# EAGLE design Rear_brake_lamp_v2 (EAGLE 7.3.0)
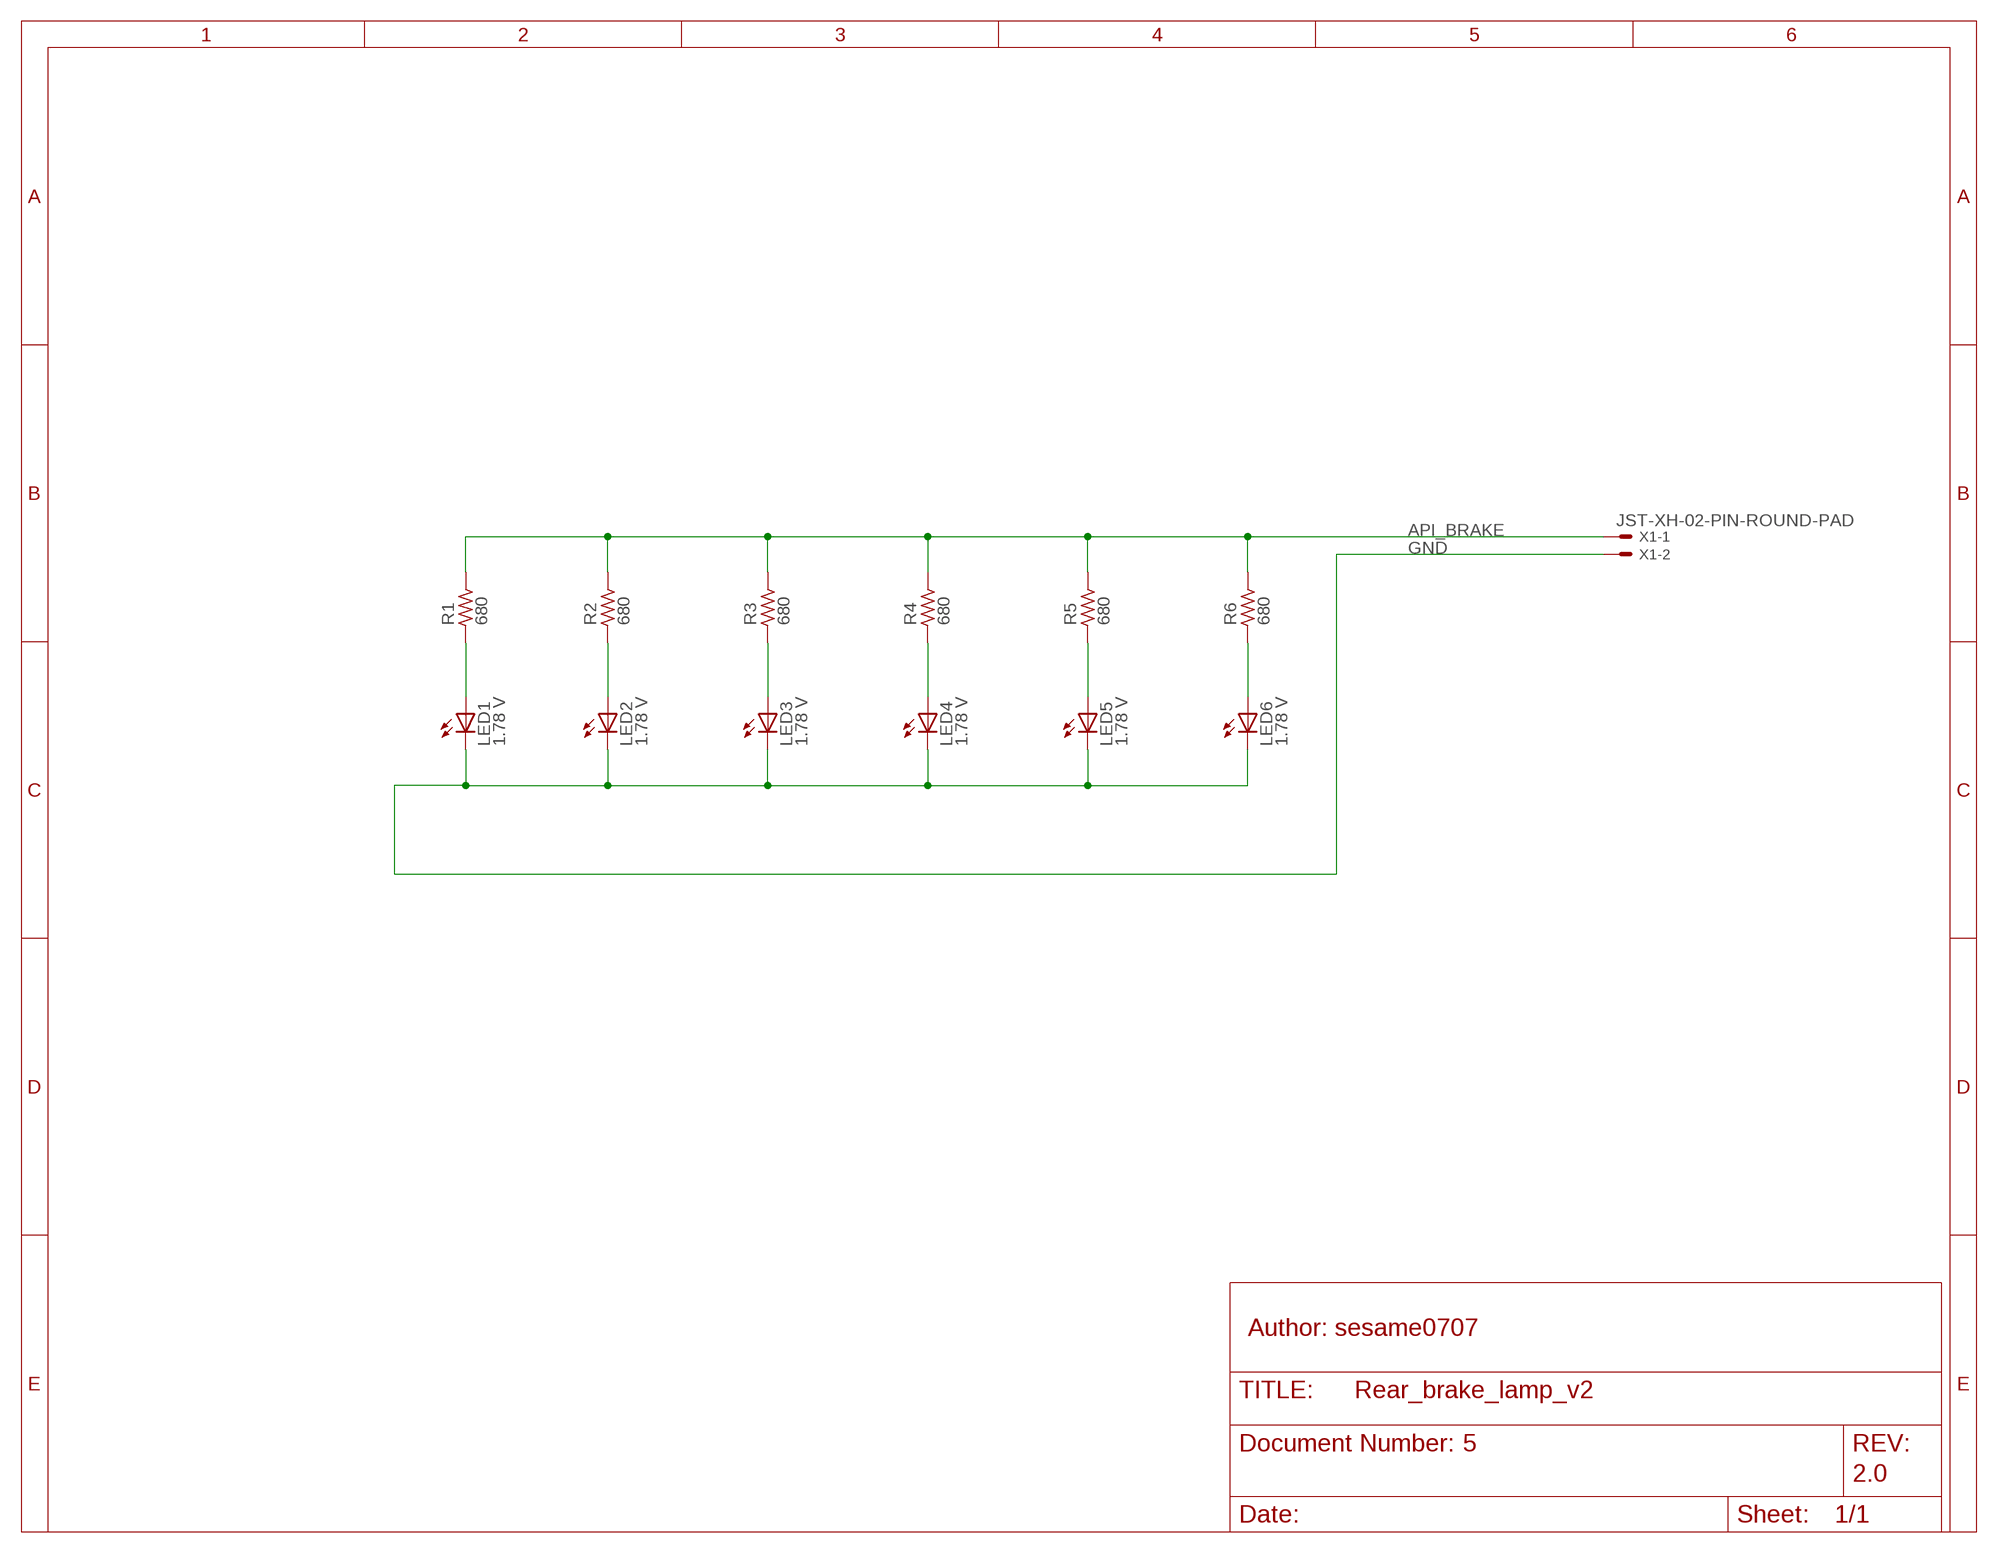
[diagram p0: schematic, sheet 1]

## Parts
LED1  1.78 V  LED5MM  [LED5MM]
LED2  1.78 V  LED5MM  [LED5MM]
LED3  1.78 V  LED5MM  [LED5MM]
LED4  1.78 V  LED5MM  [LED5MM]
LED5  1.78 V  LED5MM  [LED5MM]
LED6  1.78 V  LED5MM  [LED5MM]
R1  680  R_0805  [R0805]
R2  680  R_0805  [R0805]
R3  680  R_0805  [R0805]
R4  680  R_0805  [R0805]
R5  680  R_0805  [R0805]
R6  680  R_0805  [R0805]
X1  JST-XH-02-PIN-ROUND-PAD  [JST-XH-02-PACKAGE-ROUND-PAD]

## Nets
API_BRAKE: R1.2 R2.2 R3.2 R4.2 R5.2 R6.2 X1.1
GND: LED1.K(C) LED2.K(C) LED3.K(C) LED4.K(C) LED5.K(C) LED6.K(C) X1.2
N$1: LED1.A R1.1
N$2: LED2.A R2.1
N$3: LED3.A R3.1
N$4: LED4.A R4.1
N$5: LED5.A R5.1
N$6: LED6.A R6.1

## Notes on the sheet
- Author: sesame0707
- 5
- 2.0

## Library data of the parts
LED1-LED6 = led:LED: LED OSRAM: - CHIPLED LG R971, LG N971, LY N971, LG Q971, LY Q971, LO R971, LY R971 LH N974, LH R974 LS Q976, LO Q976, LY Q976 LO Q996 - Hyper CHIPLED LW Q18S LB Q993, LB Q99A, LB R99A - SideLED LS A670, LO A670, LY A670, LG A670, LP A670 LB A673, LV A673, LT A673, LW A673 LH A674 LY A675 LS A676, LA A676, LO A676, LY A676, LW A676 LS A679, LY A679, LG A679 - Hyper Micro SIDELED® LS Y876, LA Y876, LO Y876, LY Y876 LT Y87S - SmartLED LW L88C, LW L88S LB L89C, LB L89S, LG L890 LS L89K, LO L89K, LY L89K LS L896, LA L896, LO L896, LY L896 - TOPLED LS T670, LO T670, LY T670, LG T670, LP T670 LSG T670, LSP T670, LSY T670, LOP T670, LYG T670 LG T671, LOG T671, LSG T671 LB T673, LV T673, LT T673, LW T673 LH T674 LS T676, LA T676, LO T676, LY T676, LB T676, LH T676, LSB T676, LW T676 LB T67C, LV T67C, LT T67C, LS T67K, LO T67K, LY T67K, LW E67C LS E67B, LA E67B, LO E67B, LY E67B, LB E67C, LV E67C, LT E67C LW T67C LS T679, LY T679, LG T679 LS T770, LO T770, LY T770, LG T770, LP T770 LB T773, LV T773, LT T773, LW T773 LH T774 LS E675, LA E675, LY E675, LS T675 LS T776, LA T776, LO T776, LY T776, LB T776 LHGB T686 LT T68C, LB T68C - Hyper Mini TOPLED® LB M676 - Mini TOPLED Santana® LG M470 LS M47K, LO M47K, LY M47K Source: http://www.osram.convergy.de LUXEON: - LUMILED® LXK2-PW12-R00, LXK2-PW12-S00, LXK2-PW14-U00, LXK2-PW14-V00 LXK2-PM12-R00, LXK2-PM12-S00, LXK2-PM14-U00 LXK2-PE12-Q00, LXK2-PE12-R00, LXK2-PE12-S00, LXK2-PE14-T00, LXK2-PE14-U00 LXK2-PB12-K00, LXK2-PB12-L00, LXK2-PB12-M00, LXK2-PB14-N00, LXK2-PB14-P00, LXK2-PB14-Q00 LXK2-PR12-L00, LXK2-PR12-M00, LXK2-PR14-Q00, LXK2-PR14-R00 LXK2-PD12-Q00, LXK2-PD12-R00, LXK2-PD12-S00 LXK2-PH12-R00, LXK2-PH12-S00 LXK2-PL12-P00, LXK2-PL12-Q00, LXK2-PL12-R00 Source: www.luxeon.com KINGBRIGHT: KA-3528ASYC Source: www.kingbright.com; COLOR: Red; CURRENT: 0.32 mA
R1-R6 = rc-master-smd:R_: RESISTOR
X1 = Rembrandt Electronics - JST XH Connectors v1-0:JST-XH-02-PIN: JST XH Connector 2 Pin Wire to board connector. Pitch: 2,54 mm, (0.100") Number of pins: 2 Created by Rembrandt Electronics www.rembrandtelectronics.com

## Board
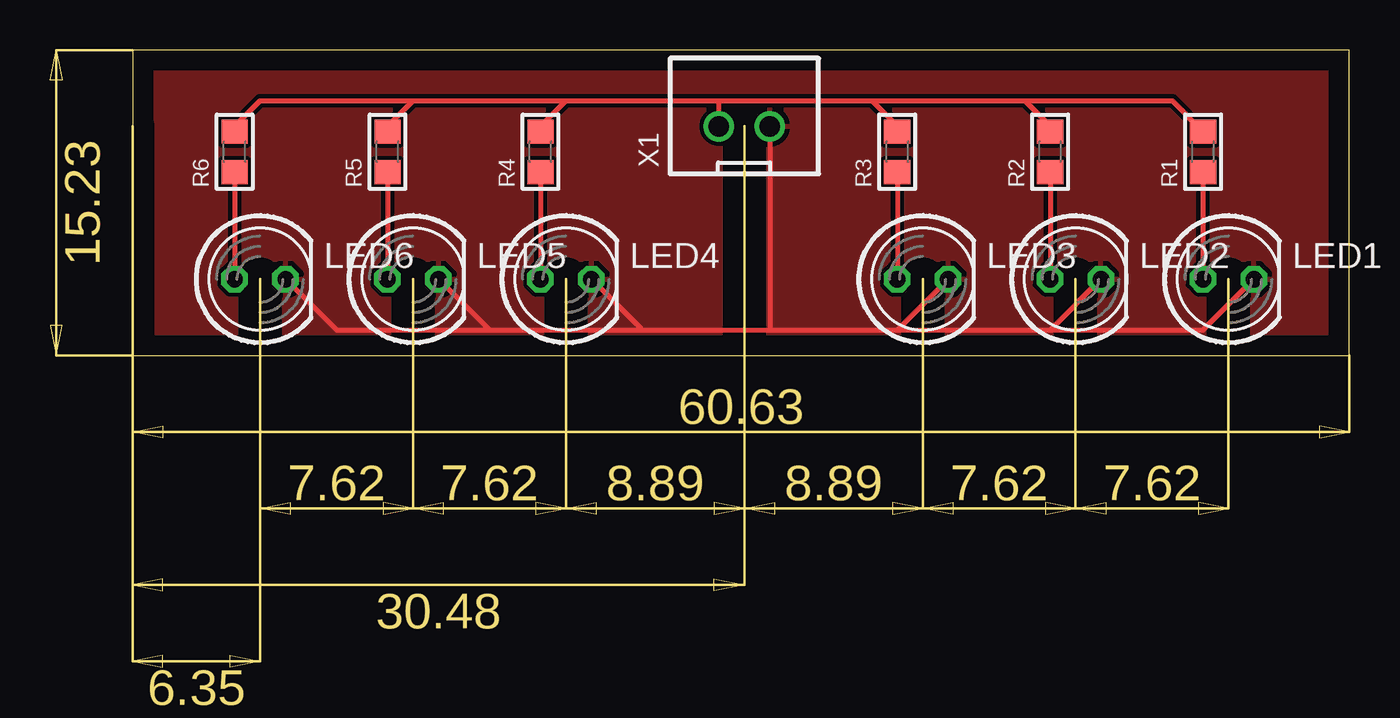
[diagram p1: board, top side]

Size 60.63 x 15.23 mm. Coordinates in mm from the lower left corner, seen from the top.
Outline: 0,0 60.63,0 60.63,15.23 0,15.23 0,0
Copper layers (1*16): Top 0.035mm / dielectric 1.5mm / Bottom 0.035mm
Design rules "default": minimum track width 10mil, minimum drill 24mil, track to track 8mil, track to pad 8mil, pad to pad 8mil, via to via 8mil, smd to smd 8mil, copper to edge 40mil, drill to drill 8mil, minimum pad ring 10mil, minimum via ring 8mil, stop-mask expansion 4mil, vias tented up to drill 0mil, thermal gap 10mil

### Footprints (pad centres in the part's own frame; a part is rotated, then mirrored left to right if it is on the bottom)
LED5MM = drill 0.813 octagon: A -1.27,0; K 1.27,0
R0805 = smd 1.2 x 1.3: 1 -1.016,0; 2 1.016,0
JST-XH-02-PACKAGE-ROUND-PAD = drill 1.016: 1 -1.27,0; 2 1.27,0

### Placement (x,y rotation side)
LED1  54.61,3.81 0 top
LED2  46.99,3.81 0 top
LED3  39.37,3.81 0 top
LED4  21.59,3.81 0 top
LED5  13.97,3.81 0 top
LED6  6.35,3.81 0 top
R1  53.34,10.16 90 top
R2  45.72,10.16 90 top
R3  38.1,10.16 90 top
R4  20.32,10.16 90 top
R5  12.7,10.16 90 top
R6  5.08,10.16 90 top
X1  30.48,11.43 0 top

### Tracks (layer width: path | path; a pad name or v marks a point on that pad's centre or on a via)
API_BRAKE
  Top 0.254: R6.2 5.08,11.43 6.35,12.7 13.97,12.7 | 13.97,12.7 21.59,12.7 | 21.59,12.7 29.21,12.7 | 29.21,12.7 36.83,12.7 | 36.83,12.7 44.45,12.7 | 44.45,12.7 51.82,12.7 R1.2 | R5.2 12.7,11.43 13.97,12.7 | R4.2 20.32,11.43 21.59,12.7 | R3.2 38.1,11.43 36.83,12.7 | R2.2 45.72,11.43 44.45,12.7 | X1.1 29.21,12.7
GND
  Top 0.254: LED6.K 10.16,1.27 17.78,1.27 | 17.78,1.27 25.4,1.27 | 25.4,1.27 31.75,1.27 | 31.75,1.27 38.1,1.27 | 38.1,1.27 45.72,1.27 | 45.72,1.27 53.34,1.27 LED1.K | LED2.K 45.72,1.27 | LED3.K 38.1,1.27 | LED5.K 17.78,1.27 | LED4.K 25.4,1.27 | X1.2 31.75,1.27
  pour Top: 0,0 0,15.24 60.96,15.24 60.96,0
N$1
  Top 0.254: R1.1 LED1.A
N$2
  Top 0.254: R2.1 LED2.A
N$3
  Top 0.254: R3.1 LED3.A
N$4
  Top 0.254: R4.1 LED4.A
N$5
  Top 0.254: R5.1 LED5.A
N$6
  Top 0.254: R6.1 LED6.A